# EAGLE design FTDI_FT230X_Example (EAGLE 9.3.2)
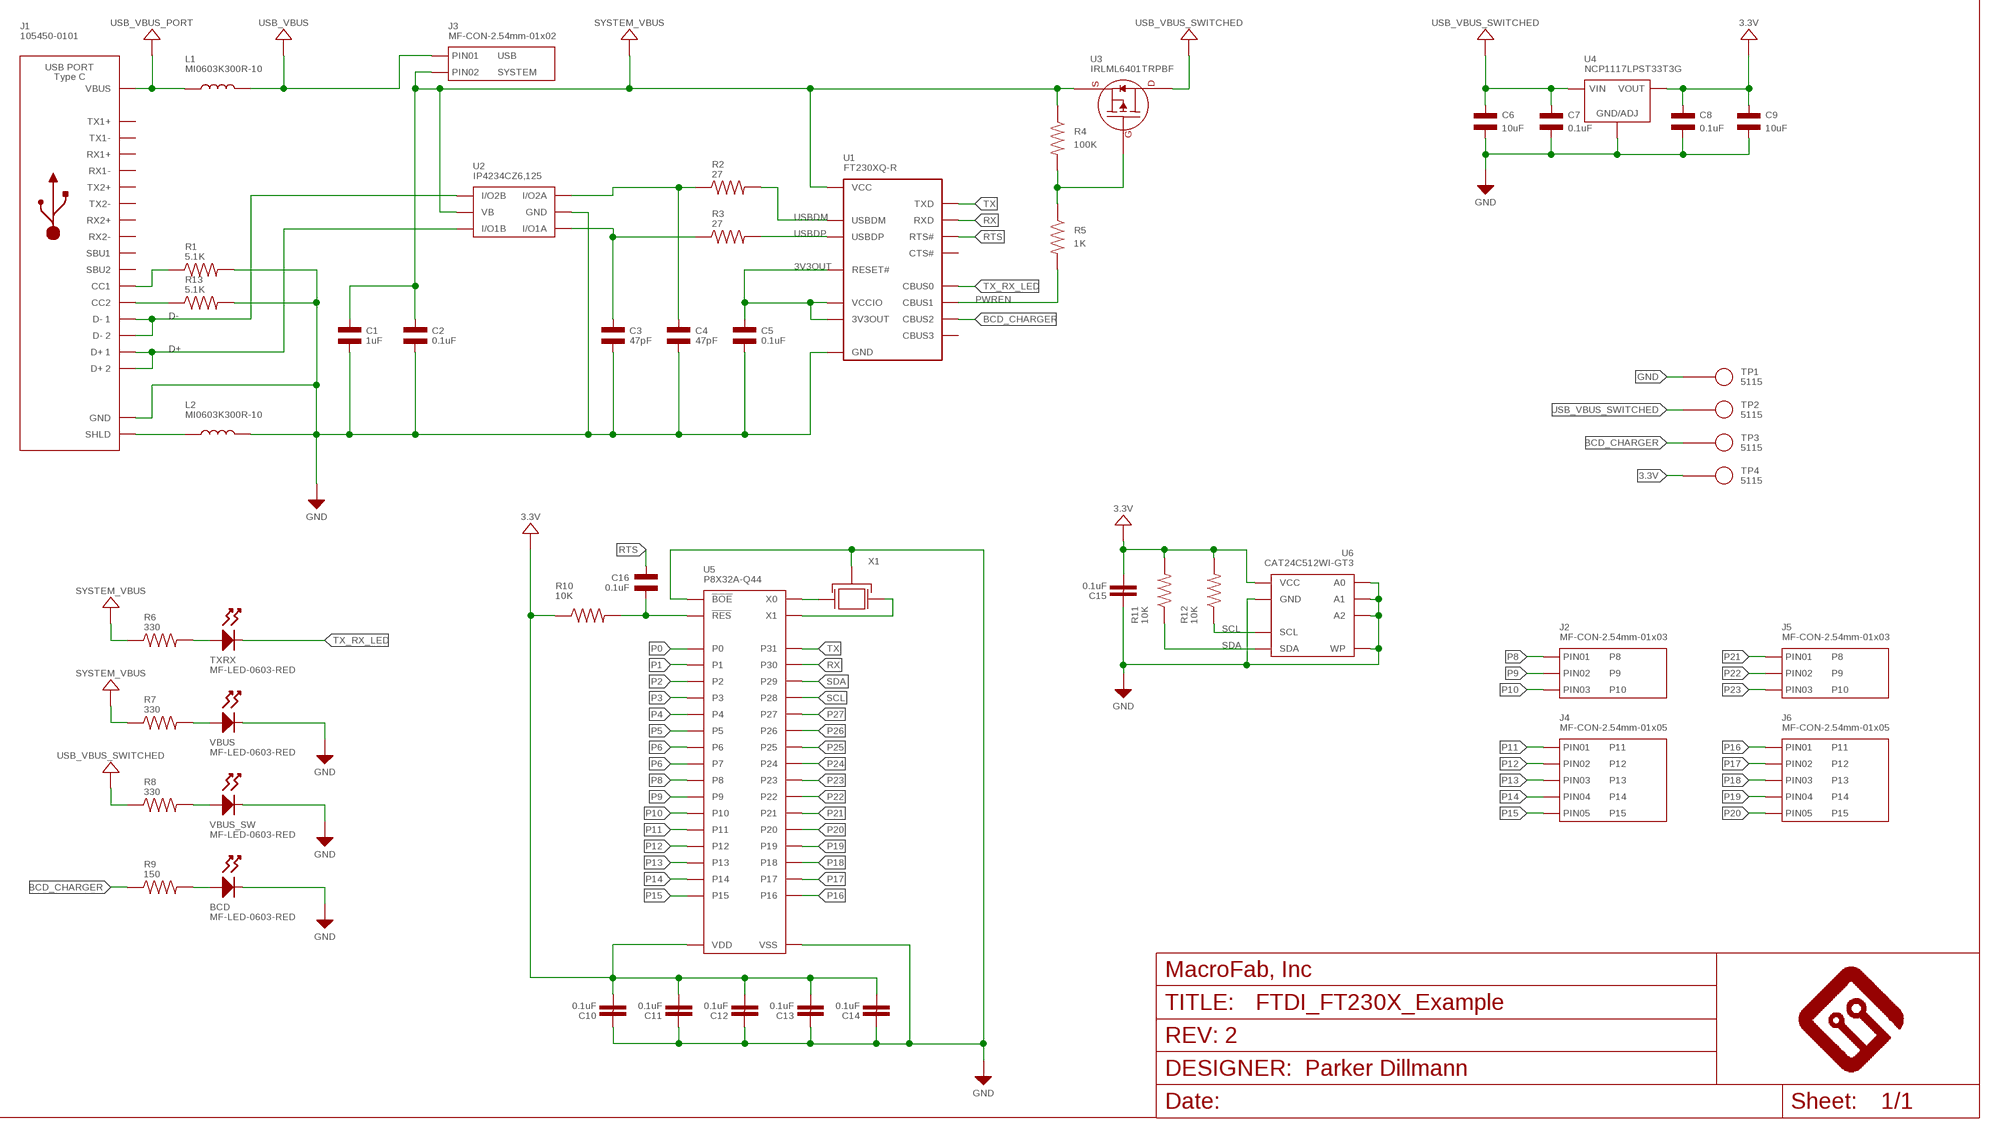
[diagram p0: schematic, sheet 1]

## Parts
BCD  MF-LED-0603-RED  LED_SINGLE-0603-RED  [LED0603]
C1  1uF  CAPACITOR_NP_0603  [C0603]
C2  0.1uF  CAPACITOR_NP_0603  [C0603]
C3  47pF  CAPACITOR_NP_0603  [C0603]
C4  47pF  CAPACITOR_NP_0603  [C0603]
C5  0.1uF  CAPACITOR_NP_0603  [C0603]
C6  10uF  CAPACITOR_NP_1206  [C1206]
C7  0.1uF  CAPACITOR_NP_0603  [C0603]
C8  0.1uF  CAPACITOR_NP_0603  [C0603]
C9  10uF  CAPACITOR_NP_1206  [C1206]
C10  0.1uF  CAPACITOR_NON_POLAR_0603  [0603]
C11  0.1uF  CAPACITOR_NON_POLAR_0603  [0603]
C12  0.1uF  CAPACITOR_NON_POLAR_0603  [0603]
C13  0.1uF  CAPACITOR_NON_POLAR_0603  [0603]
C14  0.1uF  CAPACITOR_NON_POLAR_0603  [0603]
C15  0.1uF  CAPACITOR_NON_POLAR_0603  [0603]
C16  0.1uF  CAPACITOR_NP_0603  [C0603]
FRAME1  MF_FRAMEDEFAULT  [MF_FRAME_DEFAULT]
J1  105450-0101  USB_TYPE-C_105450-0101  [105450-0101]
J2  MF-CON-2.54mm-01x03  CON_01X03_PTH_2.54MM  [PTH_2.54MM_01X03]
J3  MF-CON-2.54mm-01x02  CON_01X02_PTH_2.54MM  [PTH_2.54MM_01X02]
J4  MF-CON-2.54mm-01x05  CON_01X05_PTH_2.54MM  [PTH_2.54MM_01X05]
J5  MF-CON-2.54mm-01x03  CON_01X03_PTH_2.54MM  [PTH_2.54MM_01X03]
J6  MF-CON-2.54mm-01x05  CON_01X05_PTH_2.54MM  [PTH_2.54MM_01X05]
L1  MI0603K300R-10  INDUCTOR_0603  [L0603]
L2  MI0603K300R-10  INDUCTOR_0603  [L0603]
R1  5.1K  RESISTOR_0603  [R0603]
R2  27  RESISTOR_0603  [R0603]
R3  27  RESISTOR_0603  [R0603]
R4  100K  RESISTOR_0603  [R0603]
R5  1K  RESISTOR_0603  [R0603]
R6  330  RESISTOR_0603  [R0603]
R7  330  RESISTOR_0603  [R0603]
R8  330  RESISTOR_0603  [R0603]
R9  150  RESISTOR_0603  [R0603]
R10  10K  RESISTOR_0603  [0603]
R11  10K  RESISTOR_0603  [0603]
R12  10K  RESISTOR_0603  [0603]
R13  5.1K  RESISTOR_0603  [R0603]
TP1  5115  TEST_POINT_SINGLE_KEYSTONE_5115-5119  [KEYSTONE_5115-5119]
TP2  5115  TEST_POINT_SINGLE_KEYSTONE_5115-5119  [KEYSTONE_5115-5119]
TP3  5115  TEST_POINT_SINGLE_KEYSTONE_5115-5119  [KEYSTONE_5115-5119]
TP4  5115  TEST_POINT_SINGLE_KEYSTONE_5115-5119  [KEYSTONE_5115-5119]
TXRX  MF-LED-0603-RED  LED_SINGLE-0603-RED  [LED0603]
U1  FT230XQ-R  FT230XQ  [FT230X_QFN-16]
U2  IP4234CZ6,125  IP4234CZ6  [IP4234CZ6_SOT-457-6]
U3  IRLML6401TRPBF  MOSFET_P-CHANNEL_SINGLE_SOT-23  [SOT-23-3]
U4  NCP1117LPST33T3G  [SOT-223-3]
U5  P8X32A-Q44  [P8X32A_LQFP-44]
U6  CAT24C512WI-GT3  EEPROM_I2CSOIC-8_W  [SOIC-8_W]
VBUS  MF-LED-0603-RED  LED_SINGLE-0603-RED  [LED0603]
VBUS_SW  MF-LED-0603-RED  LED_SINGLE-0603-RED  [LED0603]
X1  ABMM-6.000MHZ-B2-T  CYRSTAL_GND_ABMM  [7MMX5MM]

## Nets
3.3V: C8.P$1 C9.P$1 C10.2 C11.2 C12.2 C13.2 C14.2 C15.2 R10.1 R11.2 R12.2 TP4.P$1 U4.P$1(VOUT) U4.P$3(VOUT) U5.8(VDD) U5.18(VDD) U5.30(VDD) U5.40(VDD) U6.8(VCC)
3V3OUT: C5.P$1 U1.1(VCCIO) U1.8(3V3OUT) U1.9(RESET#)
BCD_CHARGER: R9.P$1 TP3.P$1 U1.5(CBUS2)
CC1: J1.A5(CC1) R1.P$1
CC2: J1.B5(CC2) R13.P$1
D+: J1.A6(D+1) J1.B6(D+2) U2.3(I/O1B)
D-: J1.A7(D-1) J1.B7(D-2) U2.4(I/O2B)
GND: BCD.CATHODE C1.P$2 C2.P$2 C3.P$2 C4.P$2 C5.P$2 C6.P$2 C7.P$2 C8.P$2 C9.P$2 C10.1 C11.1 C12.1 C13.1 C14.1 C15.1 J1.A1(GND) J1.A12(GND) J1.B1(GND) J1.B12(GND) L2.P$2 R1.P$2 R13.P$2 TP1.P$1 U1.3(GND) U1.13(GND) U1.PAD(GND) U2.2(GND) U4.P$2(GND/ADJ) U5.5(VSS) U5.6(!BOE) U5.17(VSS) U5.27(VSS) U5.39(VSS) U6.1(A0) U6.2(A1) U6.3(A2) U6.4(GND) U6.7(WP) VBUS.CATHODE VBUS_SW.CATHODE X1.P$2(GND) X1.P$4(GND)
N$8: R4.P$2 R5.P$1 U3.1(GATE)
N$9: J1.S_T1(SHLD) J1.S_T2(SHLD) J1.S_T3(SHLD) J1.S_T4(SHLD) L2.P$1
N$10: R6.P$2 TXRX.ANODE
N$11: R7.P$2 VBUS.ANODE
N$12: R8.P$2 VBUS_SW.ANODE
N$13: BCD.ANODE R9.P$2
N$14: C3.P$1 R3.P$1 U2.1(I/O1A)
N$15: C4.P$1 R2.P$1 U2.6(I/O2A)
P0: U5.41(P0)
P1: U5.42(P1)
P2: U5.43(P2)
P3: U5.44(P3)
P4: U5.1(P4)
P5: U5.2(P5)
P6: U5.3(P6)
P7: U5.4(P7)
P8: J2.P$1(PIN1) U5.9(P8)
P9: J2.P$2(PIN2) U5.10(P9)
P10: J2.P$3(PIN3) U5.11(P10)
P11: J4.P$1(PIN1) U5.12(P11)
P12: J4.P$2(PIN2) U5.13(P12)
P13: J4.P$3(PIN3) U5.14(P13)
P14: J4.P$4(PIN4) U5.15(P14)
P15: J4.P$5(PIN5) U5.16(P15)
P16: J6.P$1(PIN1) U5.19(P16)
P17: J6.P$2(PIN2) U5.20(P17)
P18: J6.P$3(PIN3) U5.21(P18)
P19: J6.P$4(PIN4) U5.22(P19)
P20: J6.P$5(PIN5) U5.23(P20)
P21: J5.P$1(PIN1) U5.24(P21)
P22: J5.P$2(PIN2) U5.25(P22)
P23: J5.P$3(PIN3) U5.26(P23)
P24: U5.31(P24)
P25: U5.32(P25)
P26: U5.33(P26)
P27: U5.34(P27)
PWREN: R5.P$2 U1.11(CBUS1)
RES: C16.P$2 R10.2 U5.7(!RES)
RTS: C16.P$1 U1.16(RTS#)
RX: U1.2(RXD) U5.37(P30)
SCL: R12.1 U5.35(P28) U6.6(SCL)
SDA: R11.1 U5.36(P29) U6.5(SDA)
SYSTEM_VBUS: C1.P$1 C2.P$1 J3.P$2(PIN2) R4.P$1 R6.P$1 R7.P$1 U1.10(VCC) U2.5(VB) U3.2(SOURCE)
TX: U1.15(TXD) U5.38(P31)
TX_RX_LED: TXRX.CATHODE U1.12(CBUS0)
USB_VBUS: J3.P$1(PIN1) L1.P$2
USB_VBUS_PORT: J1.A4(VBUS) J1.A9(VBUS) J1.B4(VBUS) J1.B9(VBUS) L1.P$1
USB_VBUS_SWITCHED: C6.P$1 C7.P$1 R8.P$1 TP2.P$1 U3.3(DRAIN) U4.P$4(VIN)
USBDM: R2.P$2 U1.7(USBDM)
USBDP: R3.P$2 U1.6(USBDP)
X0: U5.29(X0) X1.P$3(X1)
X1: U5.28(X1) X1.P$1(X0)
Unconnected: J1.A2(TX1+) J1.A3(TX1-) J1.A8(SBU1) J1.A10(RX2-) J1.A11(RX2+) J1.B2(TX2+) J1.B3(TX2-) J1.B8(SBU2) J1.B10(RX1-) J1.B11(RX1+) U1.4(CTS#) U1.14(CBUS3)

## Library data of the parts
BCD TXRX VBUS VBUS_SW = MF_LEDs:LED_SINGLE: Library: MF_LEDs Description: Device for Single LED Packages. Manufacture part number (MFG#) can be added via Attributes.; HOUSEPART: YES; MPN: MF-LED-0603-RED; POPULATE: 1; URL: https://factory.macrofab.com/part/MF-LED-0603-RED
C1 = MF_Passives:CAPACITOR_NP: Library: MF_Passives Description: Device for Non-Polarized Capacitors. Manufacture part number (MPN) can be added via Attributes. Check https://factory.macrofab.com/parts for the house parts list.; MPN: MF-CAP-0603-1uF; POPULATE: 1
C2 C5 C7 C8 C16 = MF_Passives:CAPACITOR_NP: Library: MF_Passives Description: Device for Non-Polarized Capacitors. Manufacture part number (MPN) can be added via Attributes. Check https://factory.macrofab.com/parts for the house parts list.; MPN: MF-CAP-0603-0.1uF; POPULATE: 1
C3 C4 = MF_Passives:CAPACITOR_NP: Library: MF_Passives Description: Device for Non-Polarized Capacitors. Manufacture part number (MPN) can be added via Attributes. Check https://factory.macrofab.com/parts for the house parts list.; MPN: C0603C470J1GACTU; POPULATE: 1
C6 C9 = MF_Passives:CAPACITOR_NP: Library: MF_Passives Description: Device for Non-Polarized Capacitors. Manufacture part number (MPN) can be added via Attributes. Check https://factory.macrofab.com/parts for the house parts list.; MPN: MF-CAP-1206-10uF; POPULATE: 1
C10-C15 = PP_Passives:CAPACITOR_NON_POLAR: Capacitor Non Polarized; MPN: MF-CAP-0603-0.1uF
FRAME1 = MF_Aesthetics:MF_FRAME: Library: MF_Aesthetics Description: Frame for adding Meta Data to the PCB and Schematic.; DNAME: Parker Dillmann; HOUSEPART: 0; POPULATE: 0; REVNUM: REV: 2
J1 = PP_Connectors:USB_TYPE-C; MPN: 105450-0101; POPULATE: 1
J2 J5 = MF_Connectors:CON_01X03: Library: MF_Connectors Description: Header Connector with 03 Positions and 01 Rows. Use the LABEL Attribute to label the pin on the schematic and PCB. You can remove the attributes on the PCB by using the SMASH function on the part and then deleting the text.; HOUSEPART: YES; LABEL01: P8; LABEL02: P9; LABEL03: P10; MPN: MF-CON-2.54mm-01x03; POPULATE: 0; URL: https://factory.macrofab.com/part/MF-CON-2.54mm-01x03
J3 = MF_Connectors:CON_01X02: Library: MF_Connectors Description: Header Connector with 02 Positions and 01 Rows. Use the LABEL Attribute to label the pin on the schematic and PCB. You can remove the attributes on the PCB by using the SMASH function on the part and then deleting the text.; HOUSEPART: YES; LABEL01: USB; LABEL02: SYSTEM; MPN: MF-CON-2.54mm-01x02; POPULATE: 1; URL: https://factory.macrofab.com/part/MF-CON-2.54mm-01x02
J4 J6 = MF_Connectors:CON_01X05: Library: MF_Connectors Description: Header Connector with 5 Positions and 01 Rows. Use the LABEL Attribute to label the pin on the schematic and PCB. You can remove the attributes on the PCB by using the SMASH function on the part and then deleting the text.; HOUSEPART: YES; LABEL01: P11; LABEL02: P12; LABEL03: P13; LABEL04: P14; LABEL05: P15; MPN: MF-CON-2.54mm-01x05; POPULATE: 0; URL: https://factory.macrofab.com/part/MF-CON-2.54mm-01x05
L1 L2 = MF_Passives:INDUCTOR: Library: MF_Passives Description: Device for Inductors. Manufacture part number (MPN) can be added via Attributes. Check https://factory.macrofab.com/parts for the house parts list.; MPN: MI0603K300R-10; POPULATE: 1
R1 R13 = MF_Passives:RESISTOR: Library: MF_Passives Description: Device for Resistors. Manufacture part number (MPN), Voltage, Tolerance, and Wattage Rating can be added via Attributes. Check https://factory.macrofab.com/parts for the house parts list.; MPN: ERJ-3EKF5101V; POPULATE: 1
R2 R3 = MF_Passives:RESISTOR: Library: MF_Passives Description: Device for Resistors. Manufacture part number (MPN), Voltage, Tolerance, and Wattage Rating can be added via Attributes. Check https://factory.macrofab.com/parts for the house parts list.; MPN: MF-RES-0603-27; POPULATE: 1
R4 = MF_Passives:RESISTOR: Library: MF_Passives Description: Device for Resistors. Manufacture part number (MPN), Voltage, Tolerance, and Wattage Rating can be added via Attributes. Check https://factory.macrofab.com/parts for the house parts list.; MPN: MF-RES-0603-100K; POPULATE: 1
R5 = MF_Passives:RESISTOR: Library: MF_Passives Description: Device for Resistors. Manufacture part number (MPN), Voltage, Tolerance, and Wattage Rating can be added via Attributes. Check https://factory.macrofab.com/parts for the house parts list.; MPN: MF-RES-0603-1K; POPULATE: 1
R6-R8 = MF_Passives:RESISTOR: Library: MF_Passives Description: Device for Resistors. Manufacture part number (MPN), Voltage, Tolerance, and Wattage Rating can be added via Attributes. Check https://factory.macrofab.com/parts for the house parts list.; MPN: MF-RES-0603-330; POPULATE: 1
R9 = MF_Passives:RESISTOR: Library: MF_Passives Description: Device for Resistors. Manufacture part number (MPN), Voltage, Tolerance, and Wattage Rating can be added via Attributes. Check https://factory.macrofab.com/parts for the house parts list.; MPN: ERJ-3EKF1500V; POPULATE: 1
R10-R12 = PP_Passives:RESISTOR: Resistors; MPN: MF-RES-0603-10K
TP1-TP4 = PP_Connectors:TEST_POINT_SINGLE; MPN: Keystone 5115; POPULATE: 1
U1 = PP_DigitalIC:FT230X: Manufacturer Part #: FT230X Manufacturer: FTDI Description: USB Interface IC USB to Basic Serial UART IC; MPN: FT230XQ-R
U2 = PP_Passives:IP4234CZ6: Mouser Part #: 771-IP4234CZ6125 Manufacturer Part #: IP4234CZ6,125 Manufacturer: NXP Semiconductors Description: ESD Suppressors Single USB 2.0 ESD Protection 6-Pin http://www.mouser.com/ProductDetail/NXP-Semiconductors/IP4234CZ6125/?qs=sGAEpiMZZMvxHShE6Whpu7QUdHOfUl1T0xbl582qhFk%3d; MPN: IP4234CZ6,125
U3 = PP_DiscreteSemi:MOSFET_P-CHANNEL_SINGLE; MPN: IRLML6401TRPBF
U4 = MF_IC_Power:NCP1117LP: Manufacturer Part #: NCP1117LP Manufacturer: ON Semiconductor Description: LDO Voltage Regulators; HOUSEPART: NO; MPN: NCP1117LPST33T3G; POPULATE: 1; URL: http://www.onsemi.com/pub_link/Collateral/NCP1117LP-D.PDF
U5 = PP_DigitalIC:P8X32A: Manufacturer Part #: P8X32A Manufacturer: Parallax Description: 32-bit Microcontrollers - MCU Propeller Chip; MPN: P8X32A-Q44
U6 = PP_DigitalIC:EEPROM_I2C; MPN: CAT24C512WI-GT3
X1 = MF_Frequency_Control:CYRSTAL_GND: Library: MF_Frequency_Control Description: Device for two functional pin Cyrstal Oscillators and a ground.; HOUSEPART: NO; MPN: ABMM-6.000MHZ-B2-T; POPULATE: 1; URL: http://www.abracon.com/Resonators/ABMM.pdf

## Board
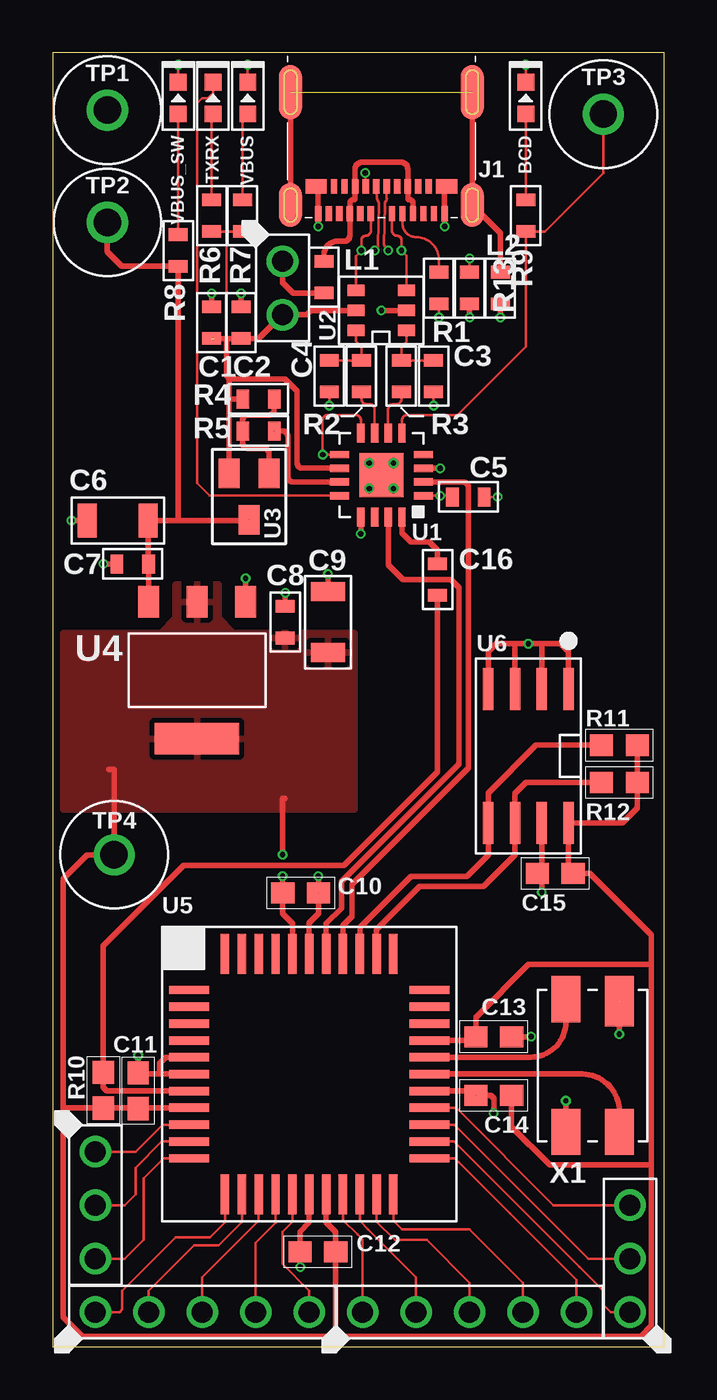
[diagram p1: board, top side]
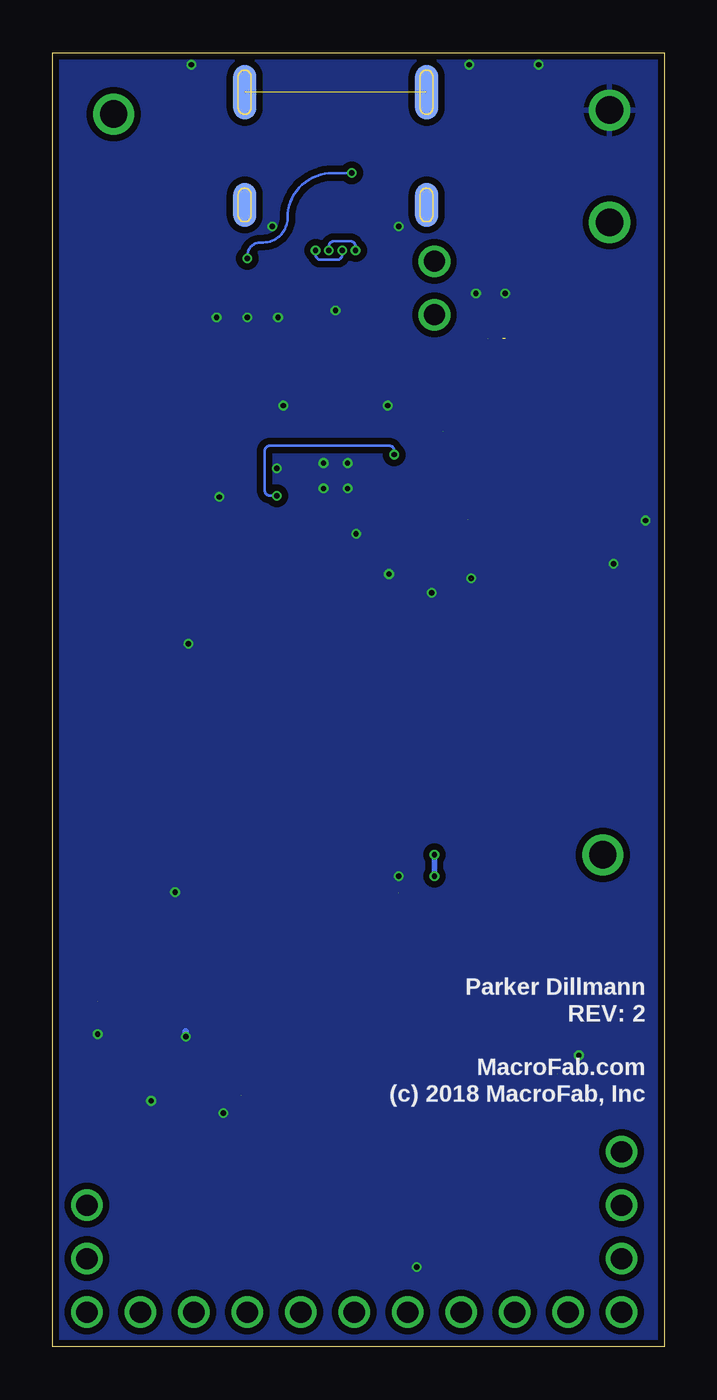
[diagram p2: board, bottom side, seen from below]

Size 29.06 x 61.47 mm. Coordinates in mm from the lower left corner, seen from the top.
Outline: 0,0 29.06,0 29.06,61.47 0,61.47 0,0
Copper layers (1*16): Top 0.035mm / dielectric 1.5mm / Bottom 0.035mm
Design rules "MF_Standard_2_Layer": minimum track width 5mil, minimum drill 10mil, track to track 5mil, track to pad 5mil, pad to pad 5mil, via to via 5mil, smd to smd 0mil, copper to edge 10mil, drill to drill 10mil, minimum pad ring 4mil, minimum via ring 4mil, stop-mask expansion 2mil, vias tented up to drill 25mil, thermal gap 10mil

### Footprints (pad centres in the part's own frame; a part is rotated, then mirrored left to right if it is on the bottom)
LED0603 = smd 0.8 x 0.8: ANODE 0.75,0; CATHODE -0.75,0
C0603 = smd 0.6 x 0.9: P$1 -0.75,0; P$2 0.75,0
C1206 = smd 0.9 x 1.6: P$1 -1.45,0; P$2 1.45,0
0603 = smd 1.1 x 1: 1 -0.85,0; 2 0.85,0
105450-0101 = smd 0.3 x 0.7: A1 -3,0.41; A2 -2.5,0.41; A3 -2,0.41; A4 -1.5,0.41; A5 -1,0.41; A6 -0.5,0.41; A7 0.5,0.41; A8 1,0.41; A9 1.5,0.41; A10 2,0.41; A11 2.5,0.41; A12 3,0.41; B2 2.25,-0.89; B3 1.75,-0.89; B4 1.25,-0.89; B5 0.75,-0.89; B6 0.25,-0.89; B7 -0.25,-0.89; B8 -0.75,-0.89; B9 -1.25,-0.89; B10 -1.75,-0.89; B11 -2.25,-0.89 | smd 1 x 0.7: B1 3.1,-0.89; B12 -3.1,-0.89 | smd 1.1 x 2.6 bottom: S_B1 -4.32,-5.36; S_B4 4.32,-5.36 | smd 1.1 x 2.1 bottom: S_B2 -4.32,0; S_B3 4.32,0 | smd 1.1 x 2.6: S_T1 -4.32,-5.36; S_T4 4.32,-5.36 | smd 1.1 x 2.1: S_T2 -4.32,0; S_T3 4.32,0
PTH_2.54MM_01X03 = drill 1: P$1 -2.54,0; P$2 0,0; P$3 2.54,0
PTH_2.54MM_01X02 = drill 1: P$1 -1.27,0; P$2 1.27,0
PTH_2.54MM_01X05 = drill 1: P$1 -5.08,0; P$2 -2.54,0; P$3 0,0; P$4 2.54,0; P$5 5.08,0
L0603 = smd 0.6 x 0.9: P$1 -0.75,0; P$2 0.75,0
R0603 = smd 0.6 x 0.9: P$1 -0.75,0; P$2 0.75,0
KEYSTONE_5115-5119 = drill 1.3: P$1 0,0
FT230X_QFN-16 = smd 0.9 x 0.35: 1 -2,0.975; 2 -2,0.325; 3 -2,-0.325; 4 -2,-0.975; 9 2,-0.975; 10 2,-0.325; 11 2,0.325; 12 2,0.975 | smd 0.35 x 0.9: 5 -0.975,-2; 6 -0.325,-2; 7 0.325,-2; 8 0.975,-2; 13 0.975,2; 14 0.325,2; 15 -0.325,2; 16 -0.975,2 | smd 2.1 x 2.1: PAD 0,0
IP4234CZ6_SOT-457-6 = smd 0.8 x 0.55: 1 -1.2,0.95; 2 -1.2,0; 3 -1.2,-0.95; 4 1.2,-0.95; 5 1.2,0; 6 1.2,0.95
SOT-23-3 = smd 1 x 1.4: 1 -0.95,-1.1; 2 0.95,-1.1; 3 0,1.1
SOT-223-3 = smd 1.5 x 4: P$1 3.25,0 | smd 1.5 x 1: P$2 -3.25,2.3; P$3 -3.25,0; P$4 -3.25,-2.3
P8X32A_LQFP-44 = smd 1.9 x 0.4: 1 -5.7,4; 2 -5.7,3.2; 3 -5.7,2.4; 4 -5.7,1.6; 5 -5.7,0.8; 6 -5.7,0; 7 -5.7,-0.8; 8 -5.7,-1.6; 9 -5.7,-2.4; 10 -5.7,-3.2; 11 -5.7,-4; 23 5.7,-4; 24 5.7,-3.2; 25 5.7,-2.4; 26 5.7,-1.6; 27 5.7,-0.8; 28 5.7,0; 29 5.7,0.8; 30 5.7,1.6; 31 5.7,2.4; 32 5.7,3.2; 33 5.7,4 | smd 0.4 x 1.9: 12 -4,-5.7; 13 -3.2,-5.7; 14 -2.4,-5.7; 15 -1.6,-5.7; 16 -0.8,-5.7; 17 0,-5.7; 18 0.8,-5.7; 19 1.6,-5.7; 20 2.4,-5.7; 21 3.2,-5.7; 22 4,-5.7; 34 4,5.7; 35 3.2,5.7; 36 2.4,5.7; 37 1.6,5.7; 38 0.8,5.7; 39 0,5.7; 40 -0.8,5.7; 41 -1.6,5.7; 42 -2.4,5.7; 43 -3.2,5.7; 44 -4,5.7
SOIC-8_W = smd 2 x 0.5: 1 -3.185,1.905; 2 -3.185,0.635; 3 -3.185,-0.635; 4 -3.185,-1.905; 5 3.185,-1.905; 6 3.185,-0.635; 7 3.185,0.635; 8 3.185,1.905
7MMX5MM = smd 1.4 x 2.2: P$1 -1.27,3.15; P$2 1.27,3.15; P$3 1.27,-3.15 | smd 1.4 x 2.4: P$4 -1.27,-3.05

### Placement (x,y rotation side)
BCD  22.48,59.31 270 top
C1  7.56,48.64 90 top
C2  8.95,48.64 90 top
C3  18.1,46.1 270 top
C4  13.14,46.1 270 top
C5  19.75,40.36 0 top
C6  3.1,39.24 180 top
C7  3.81,37.19 180 top
C8  11.05,34.42 90 top
C9  13.08,34.42 90 top
C10  11.79,21.56 180 top
C11  4.06,12.17 270 top
C12  12.6,4.52 0 top
C13  20.95,14.73 180 top
C14  20.95,11.94 0 top
C15  23.88,22.48 0 top
C16  18.29,36.45 270 top
FRAME1  0.89,11.18 180 bottom
J1  15.62,54.23 180 top
J2  2.03,6.73 270 top
J3  10.92,50.29 270 top
J4  7.11,1.65 0 top
J5  27.43,4.19 90 top
J6  19.81,1.65 0 top
L1  12.89,50.8 270 top
L2  21.27,50.29 270 top
R1  18.35,50.29 270 top
R2  14.67,46.1 270 top
R3  16.57,46.1 270 top
R4  9.78,45.02 0 top
R5  9.78,43.5 0 top
R6  7.56,53.72 90 top
R7  9.02,53.72 90 top
R8  5.97,52.07 90 top
R9  22.48,53.72 90 top
R10  2.41,12.19 90 top
R11  26.92,28.57 0 top
R12  26.92,26.8 0 top
R13  19.81,50.29 270 top
TP1  2.6,58.74 0 top
TP2  2.6,53.4 0 top
TP3  26.16,58.55 0 top
TP4  2.92,23.37 0 top
TXRX  7.62,59.31 270 top
U1  15.62,41.4 180 top
U2  15.61,49.23 180 top
U3  9.33,40.39 180 top
U4  6.86,32.13 270 top
U5  12.19,12.95 0 top
U6  22.61,28.07 270 top
VBUS  9.27,59.31 270 top
VBUS_SW  5.97,59.31 270 top
X1  25.65,13.36 180 top

### Tracks (layer width: path | path; a pad name or v marks a point on that pad's centre or on a via)
3.3V  (via drill 0.25)
  Top 0.254: R11.2 R12.2 27.77,25.59 27.06,24.88 U6.8 24.51,22.48 C15.2 25.53,22.48 28.45,19.56 28.45,18.16 | U5.40 11.39,20.12 10.94,20.57 C10.2 10.94,22.35 v10.92,22.35 | U5.8 4.06,11.35 C11.2 4.06,11.34 R10.1 0.51,11.34 | U5.18 12.99,5.91 13.44,5.46 13.44,4.45 | U5.30 20.11,14.55 C13.2 20.11,15.66 22.61,18.16 28.45,18.16 | 2.67,27.43 2.92,27.43 TP4.P$1 1.65,23.37 0.51,22.23 0.51,11.34 | 0.51,11.34 0.51,1.4 1.4,0.51 13.45,0.51 | 13.45,0.51 27.94,0.51 28.45,1.02 28.45,8.64 | 28.45,8.64 28.45,18.16 | C12.2 13.45,0.51 | C14.2 21.8,10.45 23.62,8.64 28.45,8.64 | v10.92,23.37 10.92,26.04 11.05,26.04
  Top 0.305: C12.2 13.44,4.51 13.44,4.45
  Bottom 0.254: v10.92,22.35 v10.92,23.37
  pour Top: 5.84,36.2 5.84,34.63 5.12,33.91 0.51,33.91 0.51,25.53 14.35,25.53 14.35,33.91 8.59,33.91 7.87,34.63 7.87,36.2
3V3OUT  (via drill 0.25)
  Top 0.127: 18.93,40.43 v18.41,40.43 U1.1 | U1.9 v12.83,42.38 12.83,44.01 arc-90 13.08,44.26 14.39,44.26 arc-90 14.65,44.01 U1.8
  Top 0.254: C5.P$1 18.93,40.43
  Bottom 0.127: v12.83,42.38 12.83,42.55 arc-90 13.08,42.8 18.73,42.8 arc-90 18.99,42.55 18.99,40.68 arc-90 18.73,40.43 v18.41,40.43
BCD_CHARGER
  Top 0.127: U1.5 16.6,44.01 arc-90 16.85,44.26 19.24,44.26 22.48,47.5 R9.P$1 23.38,52.97 26.16,55.75 TP3.P$1
CC1
  Top 0.127: J1.A5 16.62,53.36 arc90 17.28,52.7 arc-90 18.35,51.63 R1.P$1
CC2  (via drill 0.25)
  Top 0.127: J1.B5 14.87,55.75 v14.86,55.75 | v19.81,51.69 R13.P$1
  Bottom 0.127: v14.86,55.75 15.76,55.75 arc-90 17.91,53.6 arc90 19.06,52.45 19.18,52.45 arc-90 19.81,51.82 v19.81,51.69
D+  (via drill 0.25)
  Top 0.127: J1.B6 15.41,54.59 arc44 15.47,54.41 arc-44 15.49,54.28 15.46,52.37 arc-45 15.42,52.19 v15.3,52.07 | J1.A6 16.12,53.02 arc90 16.38,52.77 arc-90 16.57,52.57 v16.57,52.07 16.81,51.83 U2.3
  Bottom 0.127: v15.3,52.07 15.3,51.88 arc90 15.56,51.63 16.32,51.63 arc90 16.57,51.88 v16.57,52.07
D-  (via drill 0.25)
  Top 0.127: J1.B7 15.87,54.56 arc-44 15.85,54.43 arc44 15.78,54.25 15.75,52.37 arc45 15.85,52.21 v15.94,52.07 | J1.A7 15.12,53.02 arc-90 14.87,52.77 arc90 14.67,52.57 v14.67,52.07 14.41,51.81 U2.4
  Bottom 0.127: v15.94,52.07 15.94,52.26 arc90 15.68,52.51 14.93,52.51 arc90 14.67,52.26 v14.67,52.07
GND  (via drill 0.25, 0.25 pad 0.46)  (6 unrouted)
  Top 0.127: R1.P$2 v18.35,48.9 | C3.P$2 v18.1,44.7 | C4.P$2 v13.14,44.7 | 15.05,41.4 v15.05,41.97 | 15.05,41.4 U1.PAD 16.19,41.4 | 15.05,41.4 v15.05,40.77 | 16.19,41.4 v16.19,41.97 | 16.19,41.4 v16.19,40.77 | BCD.CATHODE v22.48,60.9 | VBUS_SW.CATHODE v5.97,60.9 | VBUS.CATHODE v9.27,60.9 | v21.14,40.36 C5.P$2
  Top 0.254: C13.1 v22.73,14.73 | 20.14,11.9 C14.1 20.83,11.94 20.95,11.81 v20.95,11.1 | 4.13,12.95 C11.1 | J1.B1 12.62,55.12 J1.A12 v12.62,53.21 | J1.B12 18.62,55.12 J1.A1 v18.62,53.21 | L2.P$2 v21.27,48.9 | v8.95,50.04 C2.P$2 | v7.56,50.04 C1.P$2 | U1.3 v18.41,41.73 | U1.13 v14.65,38.61 | U6.7 23.24,22.48 | 23.24,22.48 C15.1 | U6.4 20.7,33.02 21.08,33.4 21.97,33.4 | 21.97,33.4 v22.61,33.4 23.24,33.4 | 23.24,33.4 24.13,33.4 24.51,33.02 U6.1 | U6.2 23.24,33.4 | U6.3 21.97,33.4 | 23.24,22.48 v23.24,21.59 | X1.P$2 v24.38,11.68 | X1.P$4 v26.92,14.86 | C9.P$2 v13.08,36.7 | C8.P$2 v11.05,35.81 | U4.P$2 9.16,36.5 v9.17,36.5 | C7.P$2 v2.41,37.19 | C6.P$2 v0.89,39.24 | U5.27 20.11,12.15 | U5.39 12.19,20.13 12.64,20.57 C10.1 12.64,22.35 v12.62,22.35 | 5.08,12.95 4.06,12.95 C11.1 | 5.08,12.95 5.08,13.46 5.37,13.75 U5.5 | U5.17 12.19,5.91 11.75,5.46 C12.1 11.75,3.79 v11.76,3.79 | C11.1 v4.06,13.84 | U5.6 5.08,12.95 | U2.2 v15.62,49.23 | R13.P$2 v19.81,48.9
  Top 0.305: 20.11,12.15 C14.1
  Bottom 0.305: v22.73,14.73 22.73,14.99
  pour Bottom (isolate 0.305, rank 6): 0,61.47 29.08,61.47 29.08,0 0,0
N$8
  Top 0.254: R4.P$2 10.53,44.51 arc-90 10.28,44.26 9.28,44.26 arc90 9.03,44.01 R5.P$1 9.03,42.93 arc90 9.28,42.67 10.03,42.67 arc-90 10.29,42.42 U3.1
N$9  (1 unrouted)
  Top 0.254: L2.P$1 21.27,52.9 J1.S_T2 19.94,54.11 J1.S_T1 | J1.S_T4 J1.S_T3
N$10
  Top 0.127: TXRX.ANODE 7.56,58.49 R6.P$2
N$11
  Top 0.127: VBUS.ANODE 9.02,58.3 R7.P$2
N$12
  Top 0.127: VBUS_SW.ANODE R8.P$2
N$13
  Top 0.127: R9.P$2 BCD.ANODE
N$14
  Top 0.127: C3.P$1 R3.P$1 16.57,47.5 16.81,47.73 U2.1
N$15
  Top 0.127: C4.P$1 R2.P$1 14.67,47.5 14.41,47.76 U2.6
P8
  Top 0.127: U5.9 5.22,10.55 3.94,9.27 J2.P$1
P9
  Top 0.127: U5.10 5.18,9.75 3.94,8.51 3.94,7.24 3.43,6.73 J2.P$2
P10
  Top 0.127: U5.11 5.27,8.95 4.32,8 4.32,5.08 3.43,4.19 J2.P$3
P11
  Top 0.127: U5.12 8.19,5.91 7.49,5.21 5.84,5.21 3.3,2.67 3.3,1.78 3.17,1.65 J4.P$1
P12
  Top 0.127: U5.13 8.99,5.94 7.87,4.83 6.73,4.83 4.57,2.67 J4.P$2
P13
  Top 0.127: U5.14 9.79,5.98 7.11,3.3 J4.P$3
P14
  Top 0.127: U5.15 10.59,5.89 9.65,4.95 J4.P$4
P15
  Top 0.127: U5.16 11.39,5.93 10.92,5.46 10.92,3.94 12.19,2.67 J4.P$5
P16
  Top 0.127: U5.19 13.79,6.02 14.48,5.33 14.73,5.08 J6.P$1
P17
  Top 0.127: U5.20 14.59,5.98 14.99,5.59 17.27,3.3 J6.P$2
P18
  Top 0.127: U5.21 15.39,5.94 16.26,5.08 17.78,5.08 19.81,3.05 J6.P$3
P19
  Top 0.127: U5.22 16.19,5.98 16.59,5.59 19.81,5.59 22.35,3.05 J6.P$4
P20
  Top 0.127: U5.23 19.11,8.95 19.3,8.76 21.72,6.35 24.89,3.17 J6.P$5
P21
  Top 0.127: U5.24 19.07,9.75 25.02,3.81 26.16,2.67 26.16,2.01 26.52,1.65 J5.P$1
P22
  Top 0.127: U5.25 19.09,10.55 25.45,4.19 J5.P$2
P23
  Top 0.127: U5.26 19.18,11.35 23.8,6.73 J5.P$3
PWREN  (1 unrouted)
  Top 0.254: R5.P$2 10.92,43.5 arc-90 11.18,43.24 11.18,41.33 arc90 11.43,41.08 U1.11
RES
  Top 0.254: C16.P$2 18.29,27.3 13.84,22.86 6.22,22.86 2.41,19.05 R10.2 2.41,12.32 2.58,12.15 U5.7
RTS
  Top 0.254: U1.16 16.6,38.65 17.02,38.23 17.91,38.23 18.29,37.85 C16.P$1
RX
  Top 0.254: U5.37 13.79,20.02 14.22,20.45 14.22,21.97 19.75,27.5 19.75,40.82 arc90 19.49,41.08 U1.2
SCL
  Top 0.254: R12.1 22.5,26.8 21.97,26.27 U6.6 21.97,23.37 20.47,21.87 17.42,21.87 15.39,19.84 U5.35
SDA
  Top 0.254: U5.36 14.59,19.93 17.02,22.35 19.68,22.35 20.7,23.37 U6.5 20.7,26.31 22.96,28.57 R11.1
SYSTEM_VBUS  (2 unrouted)
  Top 0.127: R6.P$1 R7.P$1 | R7.P$1 8.38,52.97 | R7.P$1 8.26,52.97 8.26,47.89
  Top 0.254: U1.10 11.87,41.73 arc-90 11.62,41.98 11.62,45.4 11.05,45.97 8.38,45.97 | 8.26,47.89 8.38,47.89 C2.P$1 9.79,47.89 J3.P$2 12.06,49.02 12.27,49.23 U2.5 | 8.26,47.89 7.68,47.89 | U3.2 8.38,45.02 | 8.38,45.02 8.38,45.97 | R4.P$1 8.38,45.02 | 8.38,45.97 8.26,46.1 8.26,47.89
TX
  Top 0.254: U5.38 12.99,20.1 13.72,20.83 13.72,22.1 19.3,27.69 19.3,36.07 18.92,36.45 16.64,36.45 15.95,37.14 U1.15
TX_RX_LED
  Top 0.127: U1.12 7.45,40.43 6.86,41.02 6.86,59.05 7.11,59.31 7.37,59.31 7.62,59.56 TXRX.CATHODE
USB_VBUS
  Top 0.254: L1.P$2 11.42,50.05 10.92,50.55 J3.P$1
USB_VBUS_PORT
  Top 0.254: J1.A4 17.12,54.31 arc90 16.95,54.48 arc-90 16.87,54.56 J1.B9 16.87,55.94 arc90 16.55,56.26 14.69,56.26 arc90 14.37,55.94 J1.B4 14.37,54.56 arc-90 14.29,54.48 arc90 14.12,54.31 J1.A9 14.12,52.77 arc-90 13.87,52.51 13.55,52.51 arc90 12.89,51.85 L1.P$1
USB_VBUS_SWITCHED  (1 unrouted)
  Top 0.127: 6.22,39.29 U3.3
  Top 0.254: U4.P$4 C7.P$1 C6.P$1 5.97,39.24 | U3.3 9.34,39.24 5.97,39.24 | TP2.P$1 2.6,52.01 3.29,51.32 R8.P$1 5.97,39.24
USBDM
  Top 0.127: R2.P$2 14.67,45.02 arc90 14.92,44.77 15.05,44.77 arc-90 15.3,44.51 U1.7
USBDP
  Top 0.127: R3.P$2 16.57,45.02 arc-90 16.32,44.77 16.19,44.77 arc90 15.94,44.51 15.94,43.4 U1.6
X0
  Top 0.254: U5.29 22.7,13.75 arc90 24.38,15.44 X1.P$3
X1
  Top 0.254: U5.28 25.16,12.95 arc-90 26.92,11.19 X1.P$1